# Altium schematic sheet Wikipilot.SchDoc
size A3
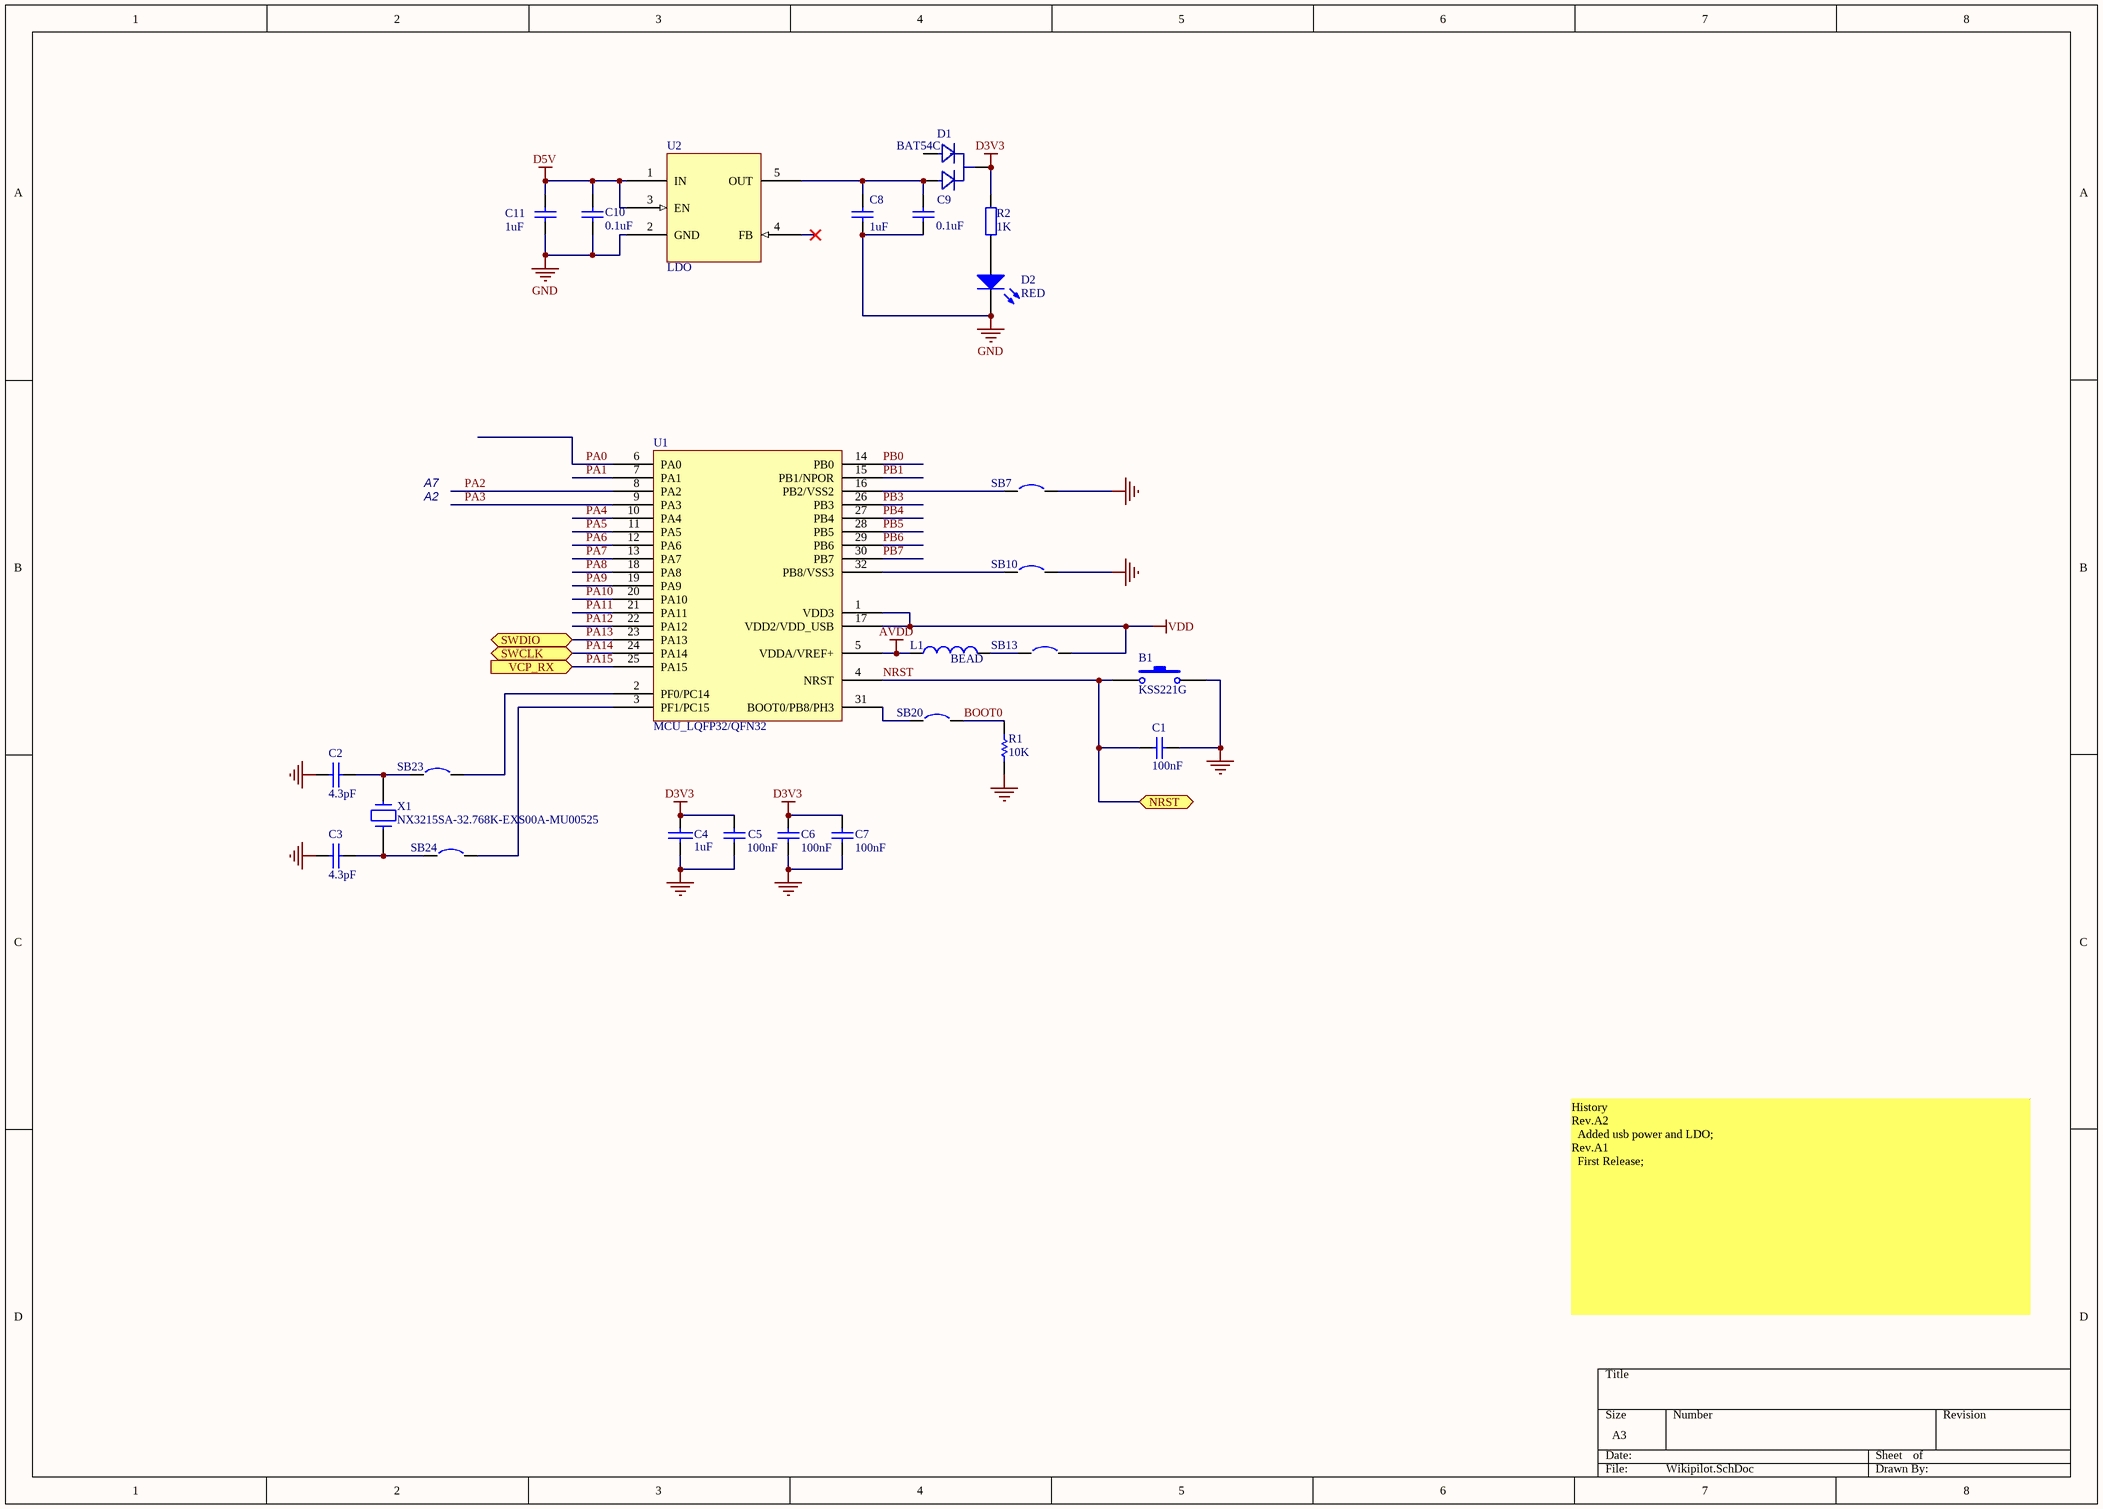
[diagram p0: Wikipilot.SchDoc]

## Parts
B1  KSS221G  [SW2_5R6_5R5x3R1]
C1  100nF  [0603C]
C2  4.3pF  [0603C]
C3  4.3pF  [0603C]
C4  1uF  [0603M]
C5  100nF  [0603M]
C6  100nF  [0603M]
C7  100nF  [0603M]
C8  1uF  [0603M]
C9  0.1uF  [0603M]
C10  0.1uF  [0603M]
C11  1uF  [0603M]
D1  BAT54C  [BAT54C]
D2  RED  [0603pn]
L1  BEAD  [0603L]
R1  10K  [0603R]
R2  1K  [0603M]
SB7  Circuit Breaker (close)  [SB_0603]  (value not drawn)
SB10  Circuit Breaker (close)  [SB_0603]  (value not drawn)
SB13  Circuit Breaker (close)  [SB_0603]  (value not drawn)
SB20  Circuit Breaker (close)  [SB_0603]  (value not drawn)
SB23  Circuit Breaker  [SB_0603]  (value not drawn)
SB24  Circuit Breaker  [SB_0603]  (value not drawn)
U1  MCU_LQFP32/QFN32  [LQFP32_0R5_7x7]
U2  LDO  [SOT23-5L]
X1  NX3215SA-32.768K-EXS00A-MU00525  [XTAL_2SM_3R2X1R5]

## Ports
NRST, SWCLK, SWDIO, VCP_RX (in)

## Nets
AVDD: L1.1 U1.5(VDDA/VREF+)
D3V3: C4.1 C5.1 C6.1 C7.1 D1.3 R2.2
D5V: C10.2 C11.2 U2.1(IN) U2.3(EN)
GND: B1.2 C1.1 C2.2 C3.2 C4.2 C5.2 C6.2 C7.2 C8.1 C9.1 C10.1 C11.1 D2.2(K) R1.2 SB7.2 SB10.2 U2.2(GND)
VDD: SB13.2 U1.1(VDD3) U1.17(VDD2/VDD_USB)
BOOT0: R1.1 SB20.2
NRST: B1.1 C1.2 U1.4(NRST) ; port NRST
PA0: U1.6(PA0)
PA1: U1.7(PA1)
PA2: U1.8(PA2)
PA3: U1.9(PA3)
PA4: U1.10(PA4)
PA5: U1.11(PA5)
PA6: U1.12(PA6)
PA7: U1.13(PA7)
PA8: U1.18(PA8)
PA9: U1.19(PA9)
PA10: U1.20(PA10)
PA11: U1.21(PA11)
PA12: U1.22(PA12)
PA13: U1.23(PA13) ; port SWDIO
PA14: U1.24(PA14) ; port SWCLK
PA15: U1.25(PA15) ; port VCP_RX
PB0: U1.14(PB0)
PB1: U1.15(PB1/NPOR)
PB3: U1.26(PB3)
PB4: U1.27(PB4)
PB5: U1.28(PB5)
PB6: U1.29(PB6)
PB7: U1.30(PB7)
NetC2_1: C2.1 SB23.1 X1.1
NetC3_1: C3.1 SB24.1 X1.2
NetC8_2: C8.2 C9.2 D1.2 U2.5(OUT)
NetD2_1: D2.1(A) R2.1
NetL1_2: L1.2 SB13.1
NetSB7_1: SB7.1 U1.16(PB2/VSS2)
NetSB10_1: SB10.1 U1.32(PB8/VSS3)
NetSB20_1: SB20.1 U1.31(BOOT0/PB8/PH3)
NetSB23_2: SB23.2 U1.2(PF0/PC14)
NetSB24_2: SB24.2 U1.3(PF1/PC15)

Not connected (* = marked no-connect by the designer): D1 1; U2 4(FB)*

## Notes on the sheet
- A2
- A7
- History
  Rev.A2
  Added usb power and LDO;
  Rev.A1
  First Release;

## Library data of the parts
B1 = SW-PB: Switch; Published: 24-Mar-1999; LatestRevisionDate: 17-Jul-2002; LatestRevisionNote: Re-released for DXP Platform.; PackageReference: SPST-2; Publisher: Altium Limited
C1 = CAP: Capacitor; Value: 100pF; Published: 8-Jun-2000; Revision: July-2002: Re-released for DXP Platform.; Publisher: Altium Limited
C2-C4 = CAP: Capacitor
C5-C7 = Cap: Capacitor; Value: 10nF; Published: 8-Jun-2000; Revision: July-2002: Re-released for DXP Platform.; Publisher: Altium Limited
C8-C11 = Cap: Capacitor; Published: 8-Jun-2000; LatestRevisionDate: 17-Jul-2002; LatestRevisionNote: Re-released for DXP Platform.; PackageReference: RAD-0.3
  C8 C11: Value: 1uF
  C9 C10: Value: 0.1uF
D1 = BAT54C: DOUBLE SHOTTKEY DIODES
D2 = LED0: Typical INFRARED GaAs LED; Published: 8-Jun-2000; LatestRevisionDate: 08-Jul-2005; LatestRevisionNote: Mech Layer 1 removed.; PackageReference: LED-0; Publisher: Altium Limited
L1 = Inductor: Value: 100uH; Published: 8-Jun-2000; Revision: July-2002: Re-released for DXP Platform.; Publisher: Altium Limited
R1 = res1: Resistor; Value: 1K; Published: 8-Jun-2000; Revision: July-2002: Re-released for DXP Platform.; Publisher: Altium Limited
R2 = Res2: Resistor; Published: 8-Jun-2000; LatestRevisionDate: 17-Jul-2002; LatestRevisionNote: Re-released for DXP Platform.; PackageReference: AXIAL-0.4; Publisher: Altium Limited; Value: 1K
SB7 SB10 SB13 SB20 SB23 SB24 = Circuit Breaker: Solder: NO; Published: 24-Mar-1999; Revision: July-2002: Re-released for DXP Platform.; Publisher: Altium Limited
U1 = MCU_LQFP32
U2 = LDO-SOT23-5: General LDO SOT23-5
X1 = CRYSTAL_32K: Crystal